# EAGLE design ballistic-amp2x (EAGLE 7.5.0)
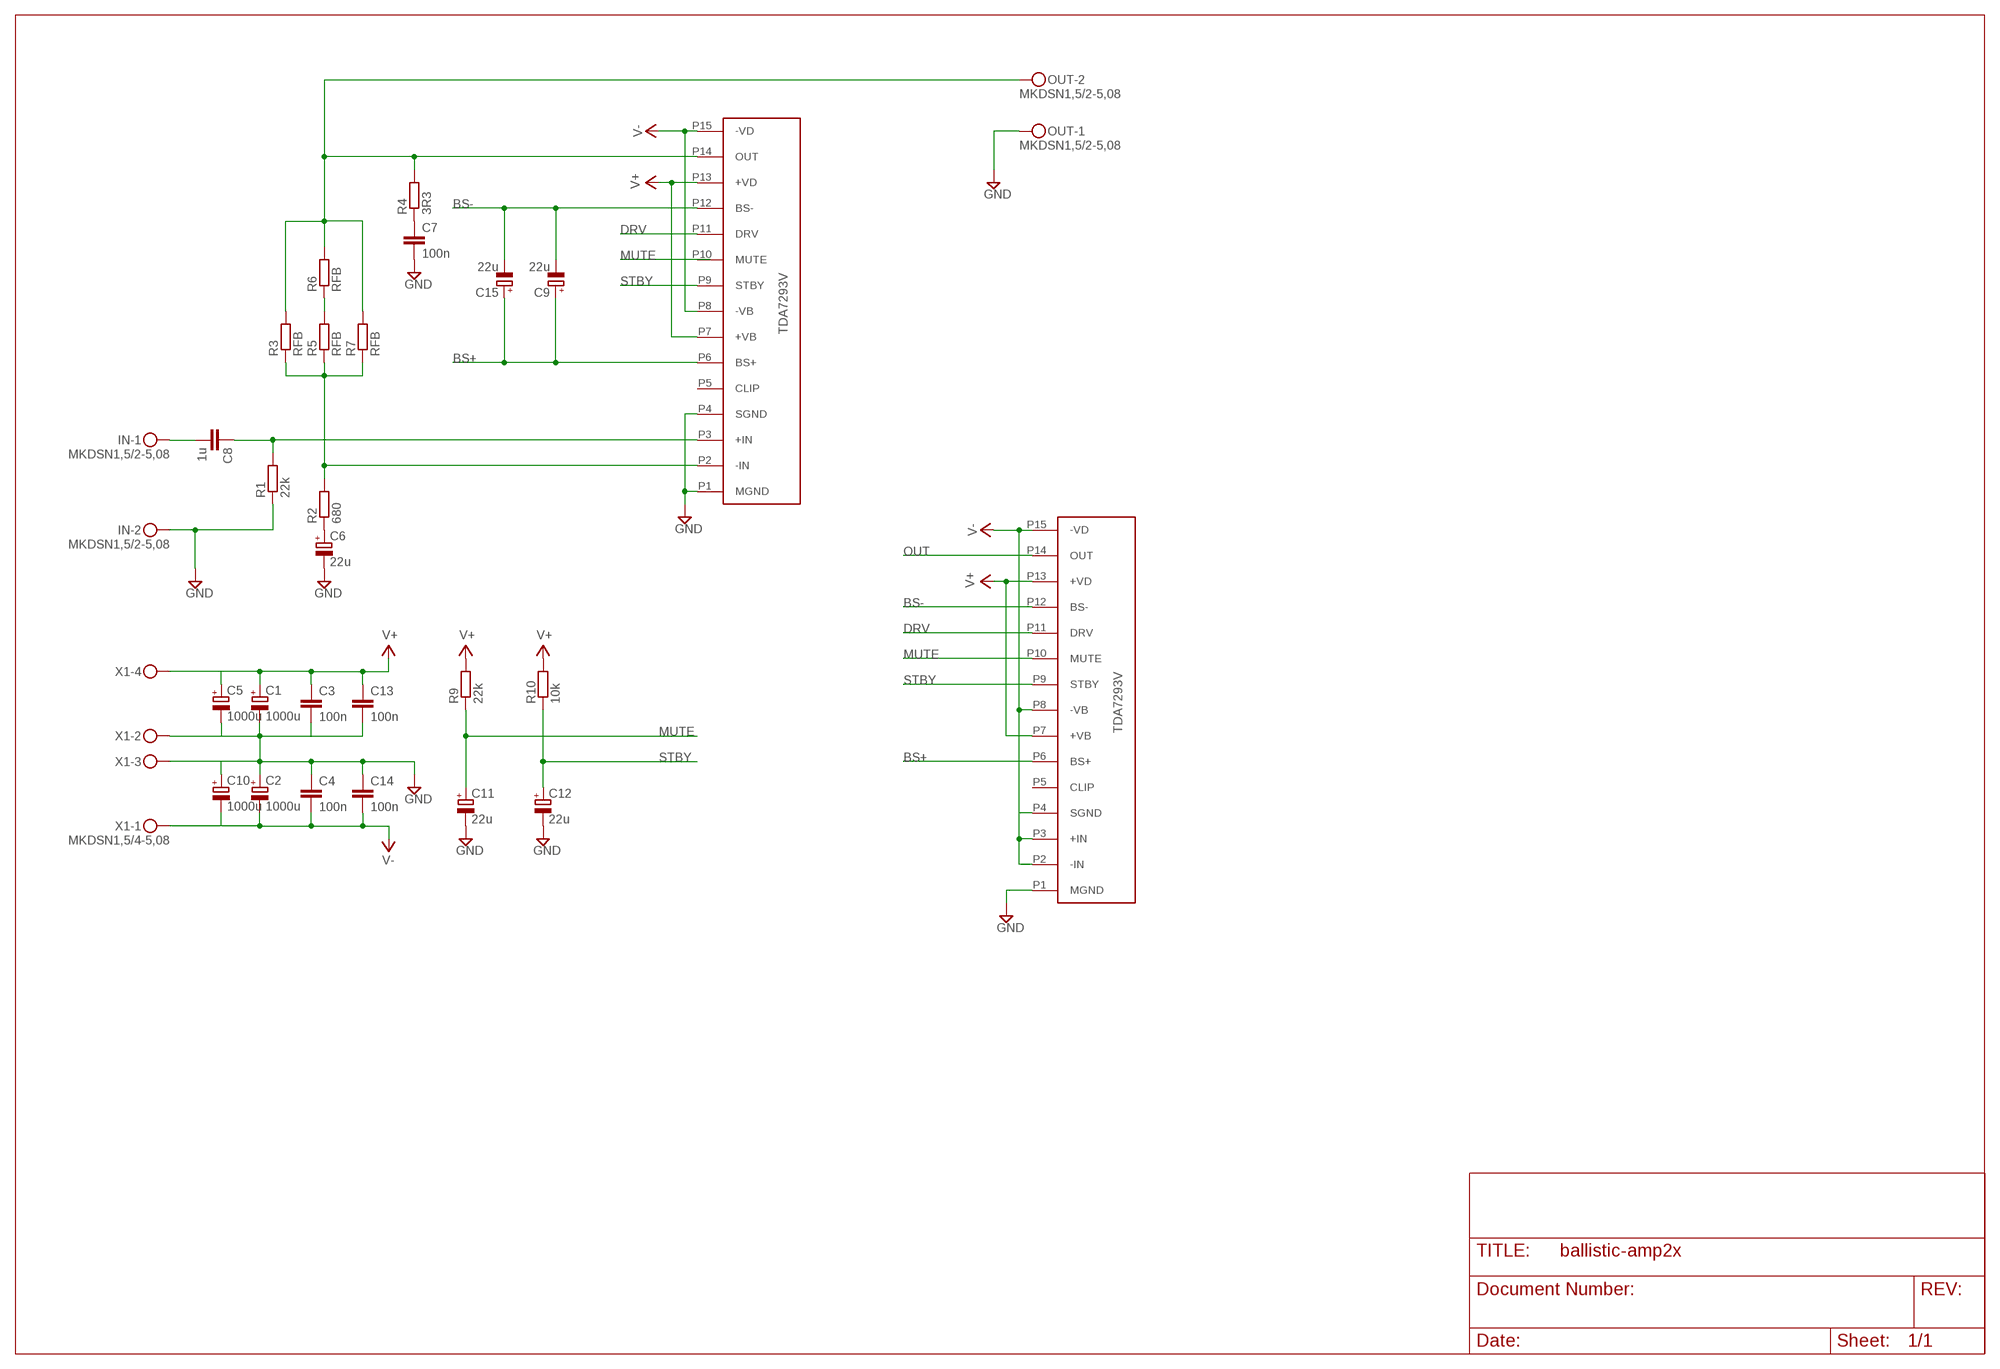
[diagram p0: schematic, sheet 1]

## Parts
C1  1000u  CPOL-EUE7.5-18  [E7,5-18]
C2  1000u  CPOL-EUE7.5-18  [E7,5-18]
C3  100n  C-EU050-025X075  [C050-025X075]
C4  100n  C-EU050-025X075  [C050-025X075]
C5  1000u  CPOL-EUE7.5-18  [E7,5-18]
C6  22u  CPOL-EUE5-10.5  [E5-10,5]
C7  100n  C-EU050-025X075  [C050-025X075]
C8  1u  C-EUC1210  [C1210]
C9  22u  CPOL-EUE5-10.5  [E5-10,5]
C10  1000u  CPOL-EUE7.5-18  [E7,5-18]
C11  22u  CPOL-EUUD-6,3X7,7  [UD-6,3X7,7_NICHICON]
C12  22u  CPOL-EUUD-6,3X7,7  [UD-6,3X7,7_NICHICON]
C13  100n  C-EU050-025X075  [C050-025X075]
C14  100n  C-EU050-025X075  [C050-025X075]
C15  22u  CPOL-EUE5-10.5  [E5-10,5]
IN  MKDSN1,5/2-5,08  [MKDSN1,5/2-5,08]
OUT  MKDSN1,5/2-5,08  [MKDSN1,5/2-5,08]
R1  22k  R-EU_0207/10  [0207/10]
R2  680  R-EU_0207/10  [0207/10]
R3  RFB  R-EU_0207/10  [0207/10]
R4  3R3  R-EU_R2512  [R2512]
R5  RFB  R-EU_0207/10  [0207/10]
R6  RFB  R-EU_0207/10  [0207/10]
R7  RFB  R-EU_0207/10  [0207/10]
R9  22k  R-EU_0207/10  [0207/10]
R10  10k  R-EU_0207/10  [0207/10]
U$1  TDA7293V  [TDA7293V]
U$2  TDA7293V  [TDA7293V]
X1  MKDSN1,5/4-5,08  [MKDSN1,5/4-5,08]

## Nets
BS+: C9.+ C15.+ U$1.P6(BS+) U$2.P6(BS+)
BS-: C9.- C15.- U$1.P12(BS-) U$2.P12(BS-)
DRV: U$1.P11(DRV) U$2.P11(DRV)
GND: C1.- C2.+ C3.2 C4.1 C5.- C6.- C7.2 C10.+ C11.- C12.- C13.2 C14.1 IN.2 OUT.1 R1.1 U$1.P1(MGND) U$1.P4(SGND) U$2.P1(MGND) X1.2 X1.3
MUTE: C11.+ R9.1 U$1.P10(MUTE)
N$1: C6.+ R2.1
N$2: R2.2 R3.1 R5.1 R7.1 U$1.P2(-IN)
N$3: C7.1 R4.1
N$4: C8.2 IN.1
N$5: C8.1 R1.2 U$1.P3(+IN)
N$7: R5.2 R6.1
OUT: OUT.2 R3.2 R4.2 R6.2 R7.2 U$1.P14(OUT) U$2.P14(OUT)
STBY: C12.+ R10.1 U$1.P9(STBY)
V+: C1.+ C3.1 C5.+ C13.1 R9.2 R10.2 U$1.P7(+VB) U$1.P13(+VD) U$2.P7(+VB) U$2.P13(+VD) X1.4
V-: C2.- C4.2 C10.- C14.2 U$1.P8(-VB) U$1.P15(-VD) U$2.P2(-IN) U$2.P3(+IN) U$2.P4(SGND) U$2.P8(-VB) U$2.P15(-VD) X1.1
Unconnected: U$1.P5(CLIP) U$2.P5(CLIP) U$2.P9(STBY) U$2.P10(MUTE)

## Library data of the parts
C1 C2 C5 C6 C9-C12 C15 = rcl:CPOL-EU: POLARIZED CAPACITOR, European symbol
C3 C4 C7 C8 C13 C14 = rcl:C-EU: CAPACITOR, European symbol
IN OUT = con-phoenix-508:MKDSN1,5/2-5,08: MKDSN 1,5/ 2-5,08 Printklemme Nennstrom: 13,5 A Nennspannung: 250 V Rastermaß: 5,08 mm Polzahl: 2 Anschlussart: Schraubanschluss Montage: Löten Anschlussrichtung Leiter/Platine: 0 ° Artikelnummer: 1729128 Source: http://eshop.phoenixcontact.com .. 1729128.pdf
R1-R7 R9 R10 = rcl:R-EU_: RESISTOR, European symbol
U$1 U$2 = TDA7293V:TDA7293V
X1 = con-phoenix-508:MKDSN1,5/4-5,08: MKDSN 1,5/ 4-5,08 Printklemme Nennstrom: 13,5 A Nennspannung: 250 V Rastermaß: 5,08 mm Polzahl: 4 Anschlussart: Schraubanschluss Montage: Löten Anschlussrichtung Leiter/Platine: 0 ° Artikelnummer: 1729144 Source: http://eshop.phoenixcontact.com .. 1729144.pdf

## Board
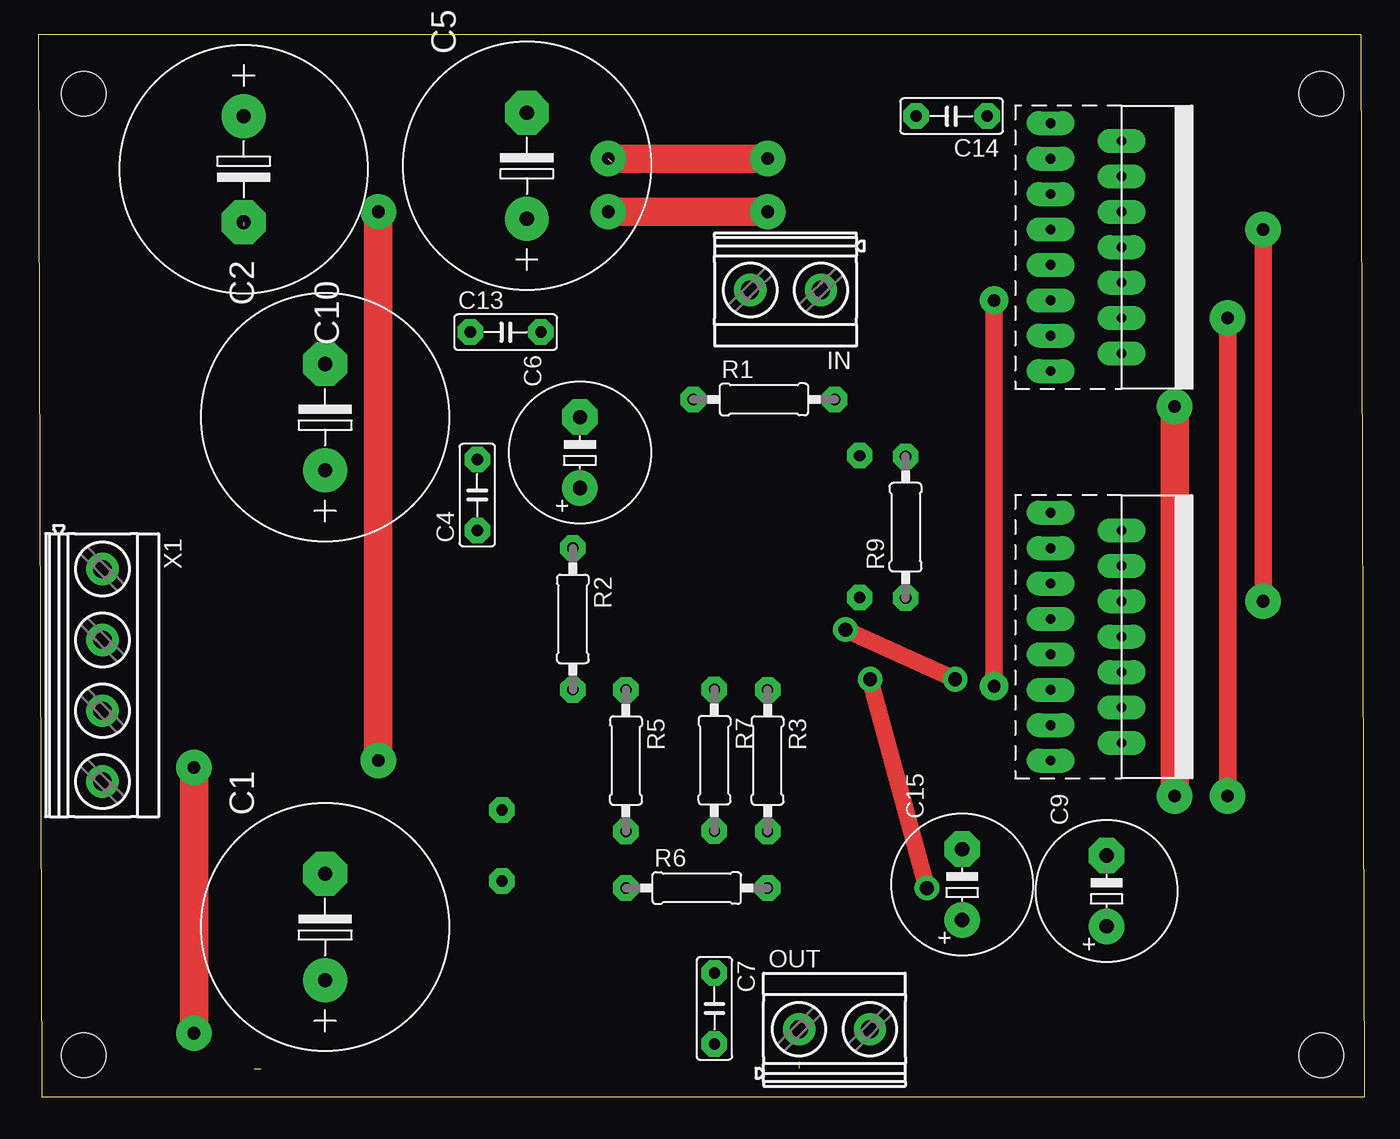
[diagram p1: board, top side]
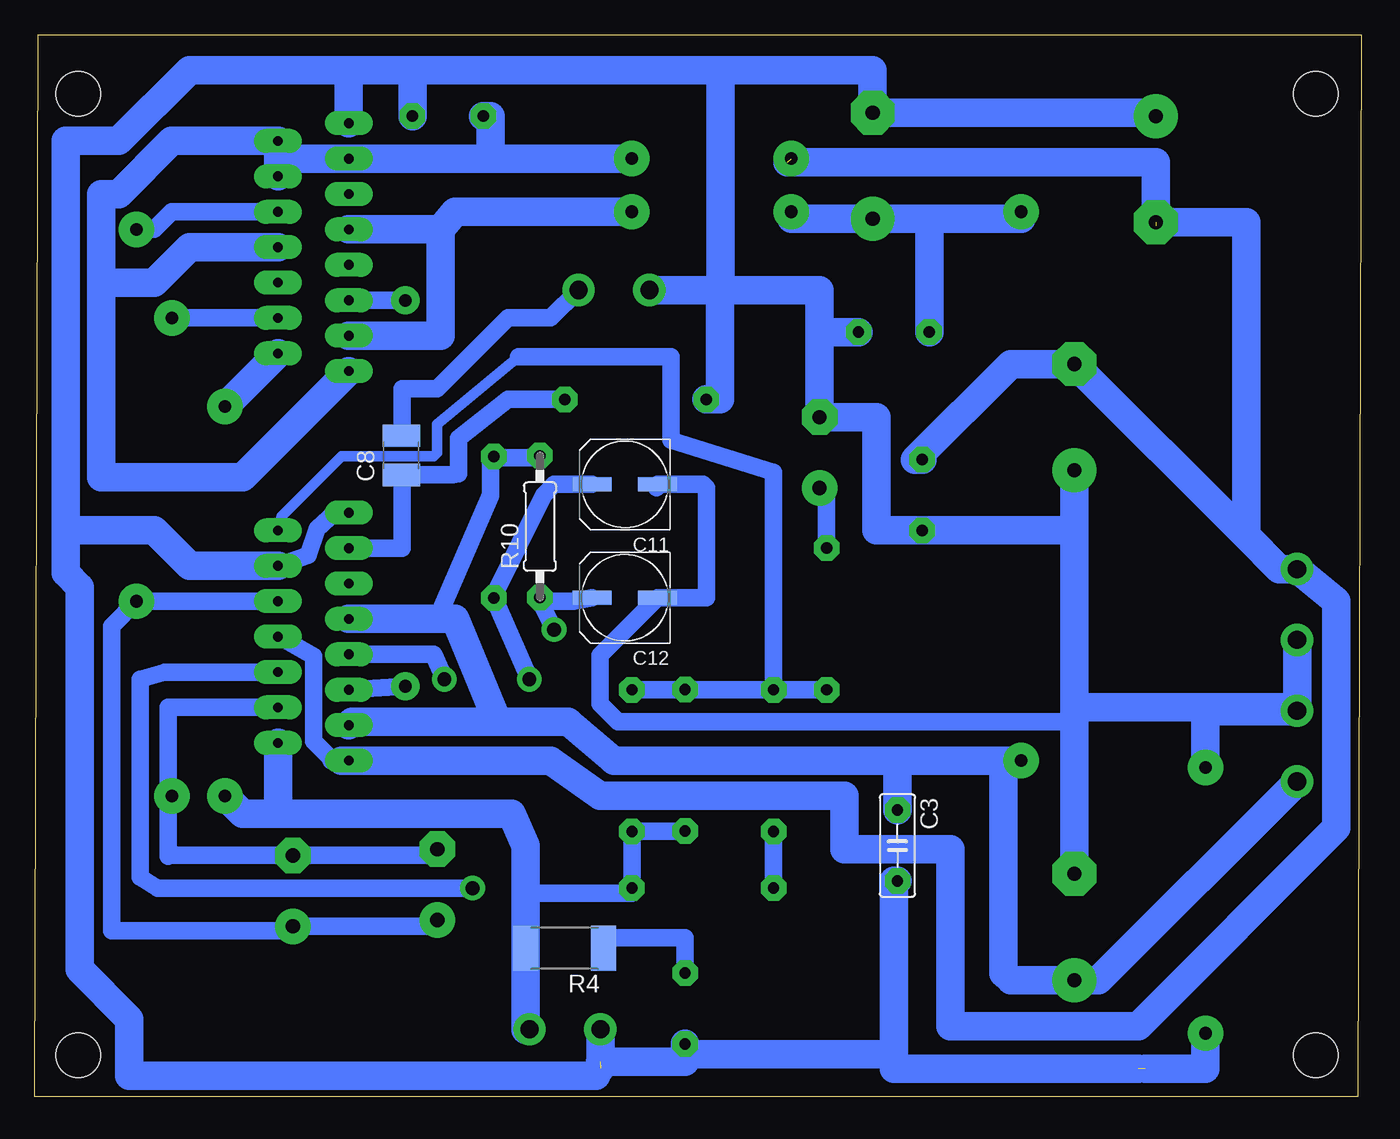
[diagram p2: board, bottom side, seen from below]

Size 95.17 x 76.19 mm. Coordinates in mm from the lower left corner, seen from the top.
Outline: 0.25,0 95.17,0 94.92,76.19 0,76.19 0.25,0
Copper layers (1*16): Top 0.035mm / dielectric 1.5mm / Bottom 0.035mm
Design rules "default *": minimum track width 50mil, minimum drill 24mil, track to track 8mil, track to pad 8mil, pad to pad 8mil, via to via 8mil, smd to smd 8mil, copper to edge 40mil, drill to drill 8mil, minimum pad ring 20mil, minimum via ring 8mil, stop-mask expansion 4mil, vias tented up to drill 0mil, thermal gap 10mil
Holes 3.2 mm at 92.06,71.97 92.06,3 3.25,3 3.25,71.97

### Footprints (pad centres in the part's own frame; a part is rotated, then mirrored left to right if it is on the bottom)
E7,5-18 = drill 1.016 pad 3.15: + -3.81,0 | drill 1.016 pad 3.15 octagon: - 3.81,0
C050-025X075 = drill 0.813 octagon: 1 -2.54,0; 2 2.54,0
E5-10,5 = drill 1.016 pad 2.54: + -2.54,0 | drill 1.016 pad 2.54 octagon: - 2.54,0
C1210 = smd 1.6 x 2.7: 1 -1.4,0; 2 1.4,0
UD-6,3X7,7_NICHICON = smd 2.8 x 1: + 2.35,0; - -2.35,0
MKDSN1,5/2-5,08 = drill 1.3 pad 2: 1 -2.561,0.025; 2 2.519,0.025
0207/10 = drill 0.813 octagon: 1 -5.08,0; 2 5.08,0
R2512 = smd 1.8 x 3.2: 1 -2.8,0; 2 2.8,0
TDA7293V = drill 0.7 pad 1.422 long: P1 1.27,-5.08; P2 2.54,0; P3 3.81,-5.08; P4 5.08,0; P5 6.35,-5.08; P6 7.62,0; P7 8.89,-5.08; P8 10.16,0; P9 11.43,-5.08; P10 12.7,0; P11 13.97,-5.08; P12 15.24,0; P13 16.51,-5.08; P14 17.78,0; P15 19.05,-5.08
MKDSN1,5/4-5,08 = drill 1.3 pad 2: 1 -7.641,0.025; 2 -2.561,0.025; 3 2.519,0.025; 4 7.599,0.025

### Placement (x,y rotation side)
C1  20.57,12.19 90 top
C2  20.57,48.77 90 top
C3  33.27,18.03 270 bottom
C4  31.5,43.18 90 top
C5  35.05,66.8 90 top
C6  38.86,46.23 90 top
C7  48.51,6.35 270 top
C8  68.88,46.02 90 bottom
C9  76.66,14.78 90 top
C10  14.73,66.55 270 top
C11  52.83,43.94 180 bottom
C12  52.83,35.81 180 bottom
C13  33.53,54.86 0 top
C14  65.53,70.36 180 top
C15  66.29,15.24 90 top
IN  53.59,57.91 180 top
OUT  57.15,4.83 0 top
R1  52.07,50.04 0 top
R2  38.35,34.29 270 top
R3  52.32,24.13 270 top
R4  57.15,10.67 180 bottom
R5  42.16,24.13 270 top
R6  47.24,14.99 0 top
R7  48.51,24.16 270 top
R9  62.23,40.87 90 top
R10  58.93,40.92 90 bottom
U$1  77.72,43.18 270 top
U$2  77.72,71.12 270 top
X1  4.57,30.23 270 top

### Tracks (layer width: path | path; a pad name or v marks a point on that pad's centre or on a via)
BS+  (via drill 0.9 pad 2.54)
  Top 1.27: v87.88,62.23 v87.88,35.56
  Bottom 1.27: U$1.P6 v87.88,35.56 89.66,33.78 89.66,11.94 76.71,11.94 76.71,12.19 C9.+ 66.75,12.24 C15.+ | v87.88,62.23 86.61,62.23 85.34,63.5 U$2.P6
BS-  (via drill 0.9 pad 2.54)
  Top 1.27: v85.34,55.88 v85.34,21.59
  Bottom 1.27: U$1.P12 85.6,27.94 85.6,21.08 | 85.6,21.08 85.6,17.78 | 85.6,17.78 85.6,17.27 | C15.- 66.75,17.32 C9.- 85.14,17.32 85.6,17.78 | U$2.P12 v85.34,55.88 | v85.34,21.59 85.34,21.34 85.6,21.08
DRV  (via drill 0.9 pad 2.03)
  Top 1.27: v68.58,57.15 v68.58,29.46
  Bottom 1.27: U$1.P11 v68.58,29.46 | U$2.P11 v68.58,57.15
GND  (via drill 0.9 pad 2.54)  (2 unrouted)
  Top 2.032: v11.18,4.57 v11.18,23.62
  Bottom 1.27: U$1.P1 73.66,41.91 74.93,40.77 75.57,38.86 U$1.P4 | 20.57,26.92 53.34,26.92 54.61,28.19 54.61,31.69 C12.- 46.99,35.81 46.99,43.69 47.24,43.94 50.29,43.94 50.55,43.69 50.55,43.88 C11.-
  Bottom 2.032: X1.3 X1.2 | IN.2 45.97,57.89 | 45.97,57.89 38.86,57.89 38.86,54.86 | 38.86,54.86 C6.- 34.8,48.77 34.8,40.64 C4.1 20.57,40.64 | R1.1 45.99,50.04 45.99,57.87 45.97,57.89 | C3.2 33.53,15.49 33.53,3.05 | 33.53,3.05 48.51,3.05 | 48.51,3.05 C7.2 | 54.61,2.54 48.51,2.54 48.51,3.05 | 72.64,73.66 67.56,73.66 | 67.56,73.66 45.97,73.66 | 45.97,73.66 35.05,73.66 C5.- 14.73,70.61 C10.+ | 55.12,1.52 88.39,1.52 88.39,5.59 91.95,9.14 91.95,36.58 92.96,37.59 92.96,40.64 | 55.12,1.52 54.88,1.52 | OUT.1 54.59,2.05 55.12,1.52 | X1.3 5.1,27.71 5.33,27.94 20.57,27.94 | 20.57,27.94 20.57,26.92 C1.- | 20.57,27.94 20.57,40.64 | 20.57,40.64 C2.+ | U$2.P1 72.64,73.66 | 72.64,73.66 84.07,73.66 89.15,68.58 92.96,68.58 92.96,40.64 | 92.96,40.64 86.61,40.64 84.07,38.1 U$1.P4 | 45.97,57.15 45.97,73.66 | C14.1 68.07,73.15 67.56,73.66 | C13.2 38.86,54.86 | 16,2.03 33.53,2.03 33.53,3.05 | 11.18,23.37 v11.18,23.62 11.18,27.69 4.6,27.69 X1.3 | 15.49,2.03 11.18,2.03 v11.18,4.57 11.18,4.83
MUTE  (via drill 1 pad 1.78)
  Top 1.27: v59.69,29.97 v63.75,14.99
  Bottom 1.27: C11.+ 57.91,43.94 58.67,43.18 62.1,36.2 62.23,35.56 R9.1 v59.69,29.97 | U$1.P10 85.85,30.48 87.63,29.97 87.63,15.75 86.36,14.99 v63.75,14.99
N$1
  Bottom 1.27: R2.1 38.35,43.18 C6.+
N$2
  Bottom 0.762: U$1.P2 77.47,41.66 73.15,45.97 66.55,45.97 66.29,46.23 66.29,48.26 60.45,53.09
  Bottom 1.27: 48.51,29.21 R3.1 | 60.45,53.09 49.53,53.09 49.53,47.12 42.16,44.83 R5.1 | R5.1 R2.2 | R5.1 48.51,29.21 | 48.51,29.21 R7.1
N$3
  Bottom 1.27: C7.1 48.51,11.43 54.23,11.43 R4.1
N$4
  Bottom 1.27: C8.2 68.83,47.48 68.83,50.8 66.29,50.8 61.21,55.88 58.16,55.88 IN.1
N$5
  Bottom 1.27: U$1.P3 68.83,39.37 68.83,44.57 C8.1 65.2,44.62 64.77,44.7 64.77,47.24 61.21,50.04 R1.2 57.15,49.78
N$7
  Bottom 1.27: R5.2 R6.1
OUT  (via drill 0.9 pad 2.54)
  Top 2.032: v81.53,21.59 v81.53,49.53
  Bottom 0.097: OUT.2 59.67,4.55 59.69,4.83
  Bottom 1.27: R7.2 48.51,19.05 R3.2 R6.2 52.32,14.61 59.94,14.61 59.94,12.06 R4.2
  Bottom 2.032: v81.53,21.59 80.26,20.32 77.72,20.32 | 77.72,20.32 60.96,20.32 59.94,18.03 59.94,11.68 | 59.94,11.68 59.94,4.83 59.69,4.83 | R4.2 59.94,11.68 | v81.53,49.53 U$2.P14 | U$1.P14 77.72,20.32
STBY  (via drill 1 pad 1.78)
  Top 1.27: v57.91,33.53 v65.79,29.97
  Bottom 1.27: 58.93,35.56 56.52,35.56 C12.+ | 58.93,35.56 R10.1 58.93,35.94 | 58.93,35.56 v57.91,33.53 | U$1.P9 66.55,31.75 v65.79,29.97
V+  (via drill 0.9 pad 2.54)
  Top 2.032: v40.89,63.5 v52.32,63.5 | v24.38,24.13 v24.38,63.5
  Bottom 1.27: R10.2 59.05,45.85 61.98,45.85 R9.2 62.48,45.95 62.48,43.18 66.29,34.29
  Bottom 2.032: 61.98,26.92 56.9,26.92 53.59,24.13 33.27,24.13 | 61.98,26.92 72.39,26.92 U$1.P13 | 25.65,24.13 25.65,8.89 25.15,8.38 C1.+ 18.84,8.38 X1.4 | C3.1 33.27,24.13 | 33.27,24.13 25.65,24.13 | U$2.P13 66.04,54.61 66.04,62.23 | 66.04,62.23 65.02,63.5 v52.32,63.5 | C5.+ 40.89,62.99 v40.89,63.5 | U$2.P7 66.04,62.23 | C5.+ 24.38,62.99 v24.38,63.5 | 25.65,24.13 v24.38,24.13 | C5.+ 30.99,62.99 C13.1 | U$1.P7 66.29,34.29 65.02,34.29 61.98,26.92
V-  (via drill 0.9 pad 2.54)  (2 unrouted)
  Top 2.032: v52.32,67.31 v40.89,67.31
  Bottom 1.27: U$1.P15 73.15,24.13 73.91,24.13 73.91,24.26 75.18,25.53 75.18,31.62 77.6,33.02 U$1.P8
  Bottom 2.032: 73.15,24.13 58.17,24.13 54.61,21.59 37.08,21.59 37.08,17.78 29.46,17.78 29.46,5.08 16,5.08 1.78,19.3 1.78,35.56 X1.1 5.86,37.87 8.25,40.26 | C4.2 32,45.72 25.15,52.58 C2.- 8.25,40.26 | 8.25,40.26 8.25,62.74 C10.- | 62.48,67.31 U$2.P3 77.72,67.31 | 62.48,67.31 v52.32,67.31 | 41.15,67.06 14.73,67.06 14.73,62.48 | U$2.P15 80.26,44.45 90.42,44.45 90.42,58.42 | 90.42,58.42 90.42,64.77 89.15,64.77 85.34,68.58 U$2.P2 77.72,67.31 | U$2.P8 84.07,60.96 86.61,58.42 90.42,58.42 | C14.2 62.48,70.36 62.48,67.31 | U$2.P4 77.72,67.31